# EAGLE schematic motorline (EAGLE 9.5.1)
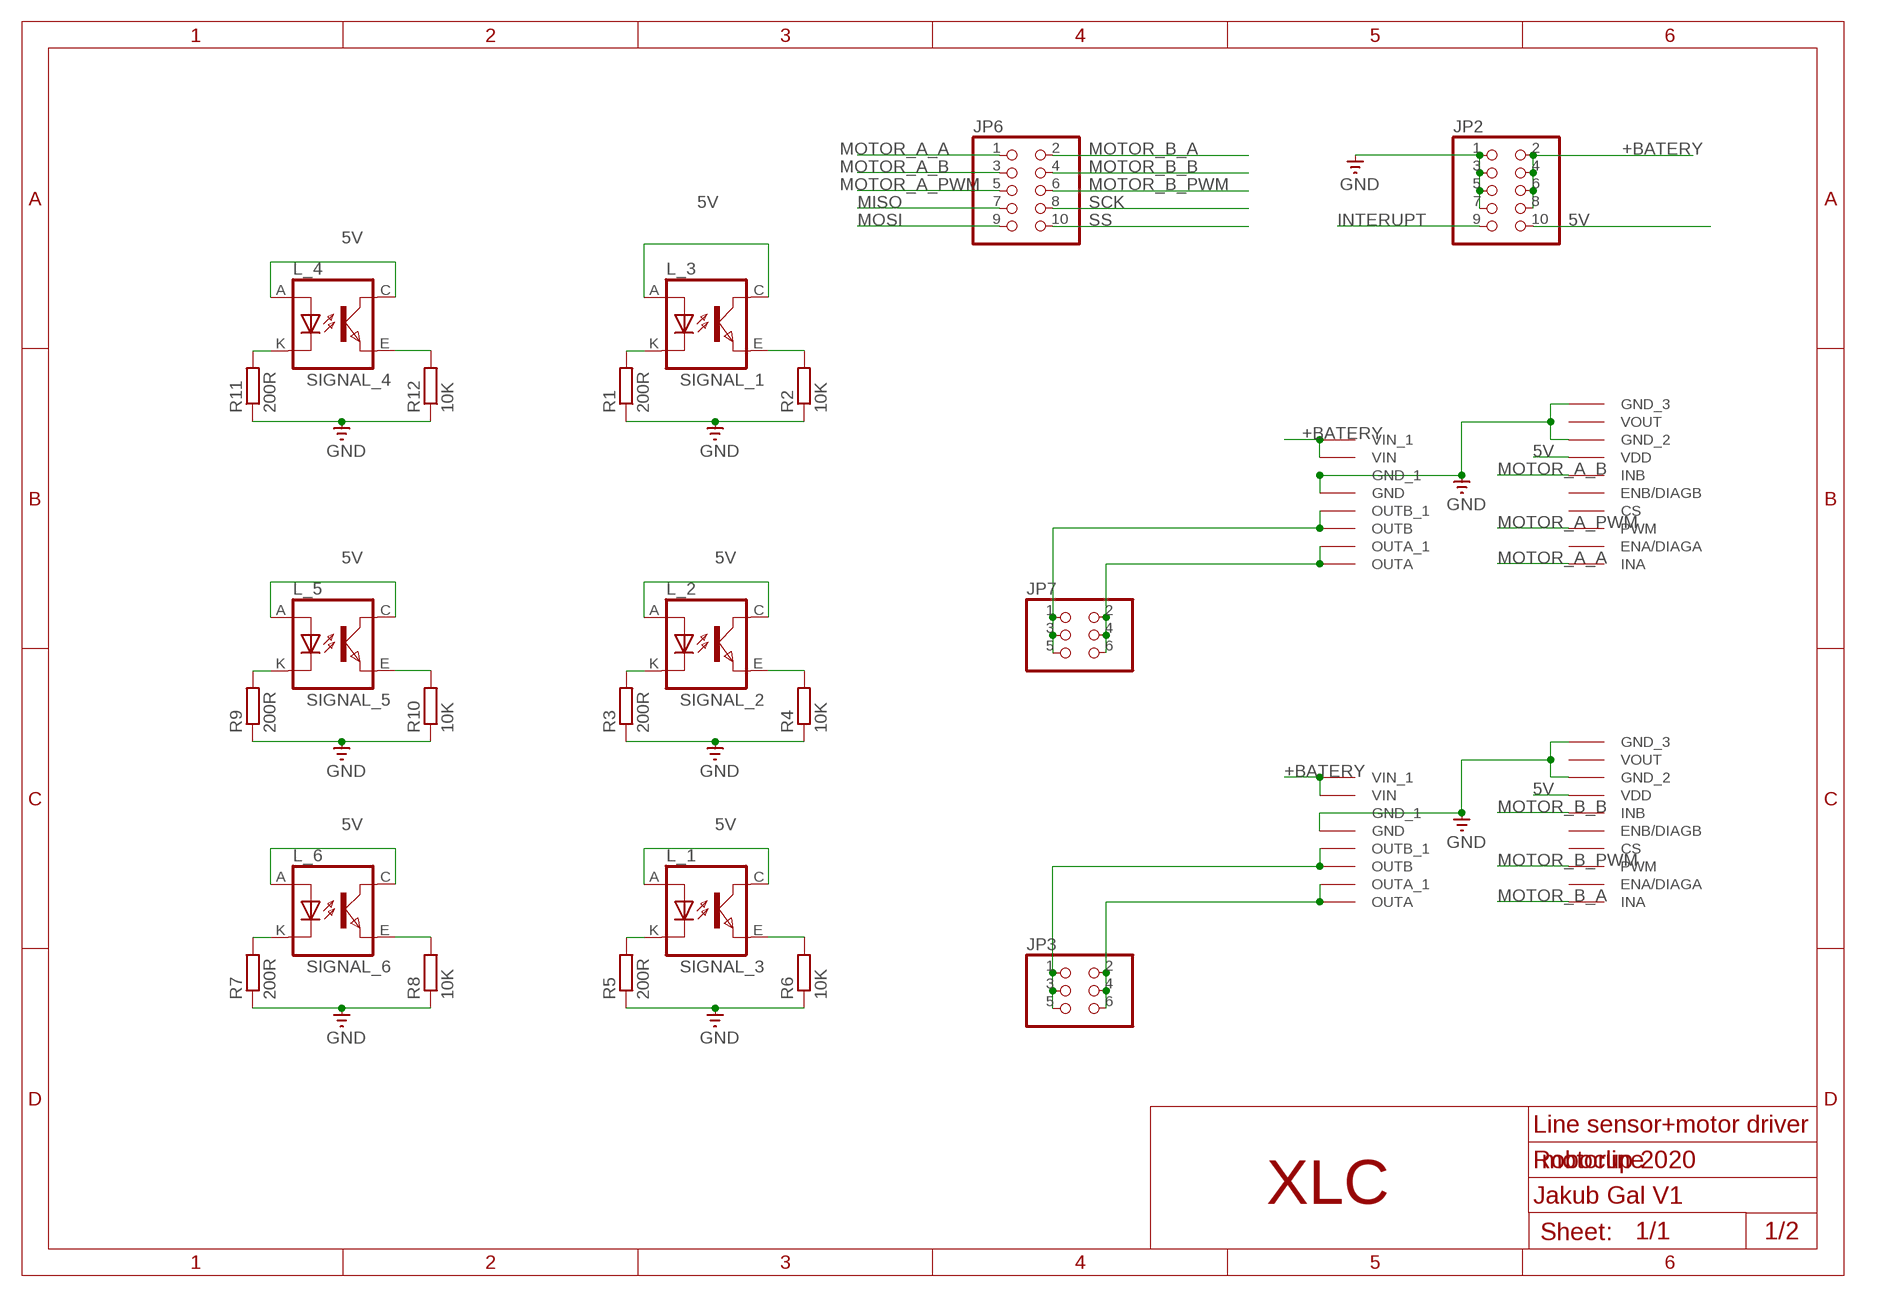
[diagram p0: schematic, sheet 1, part 1 of 2]
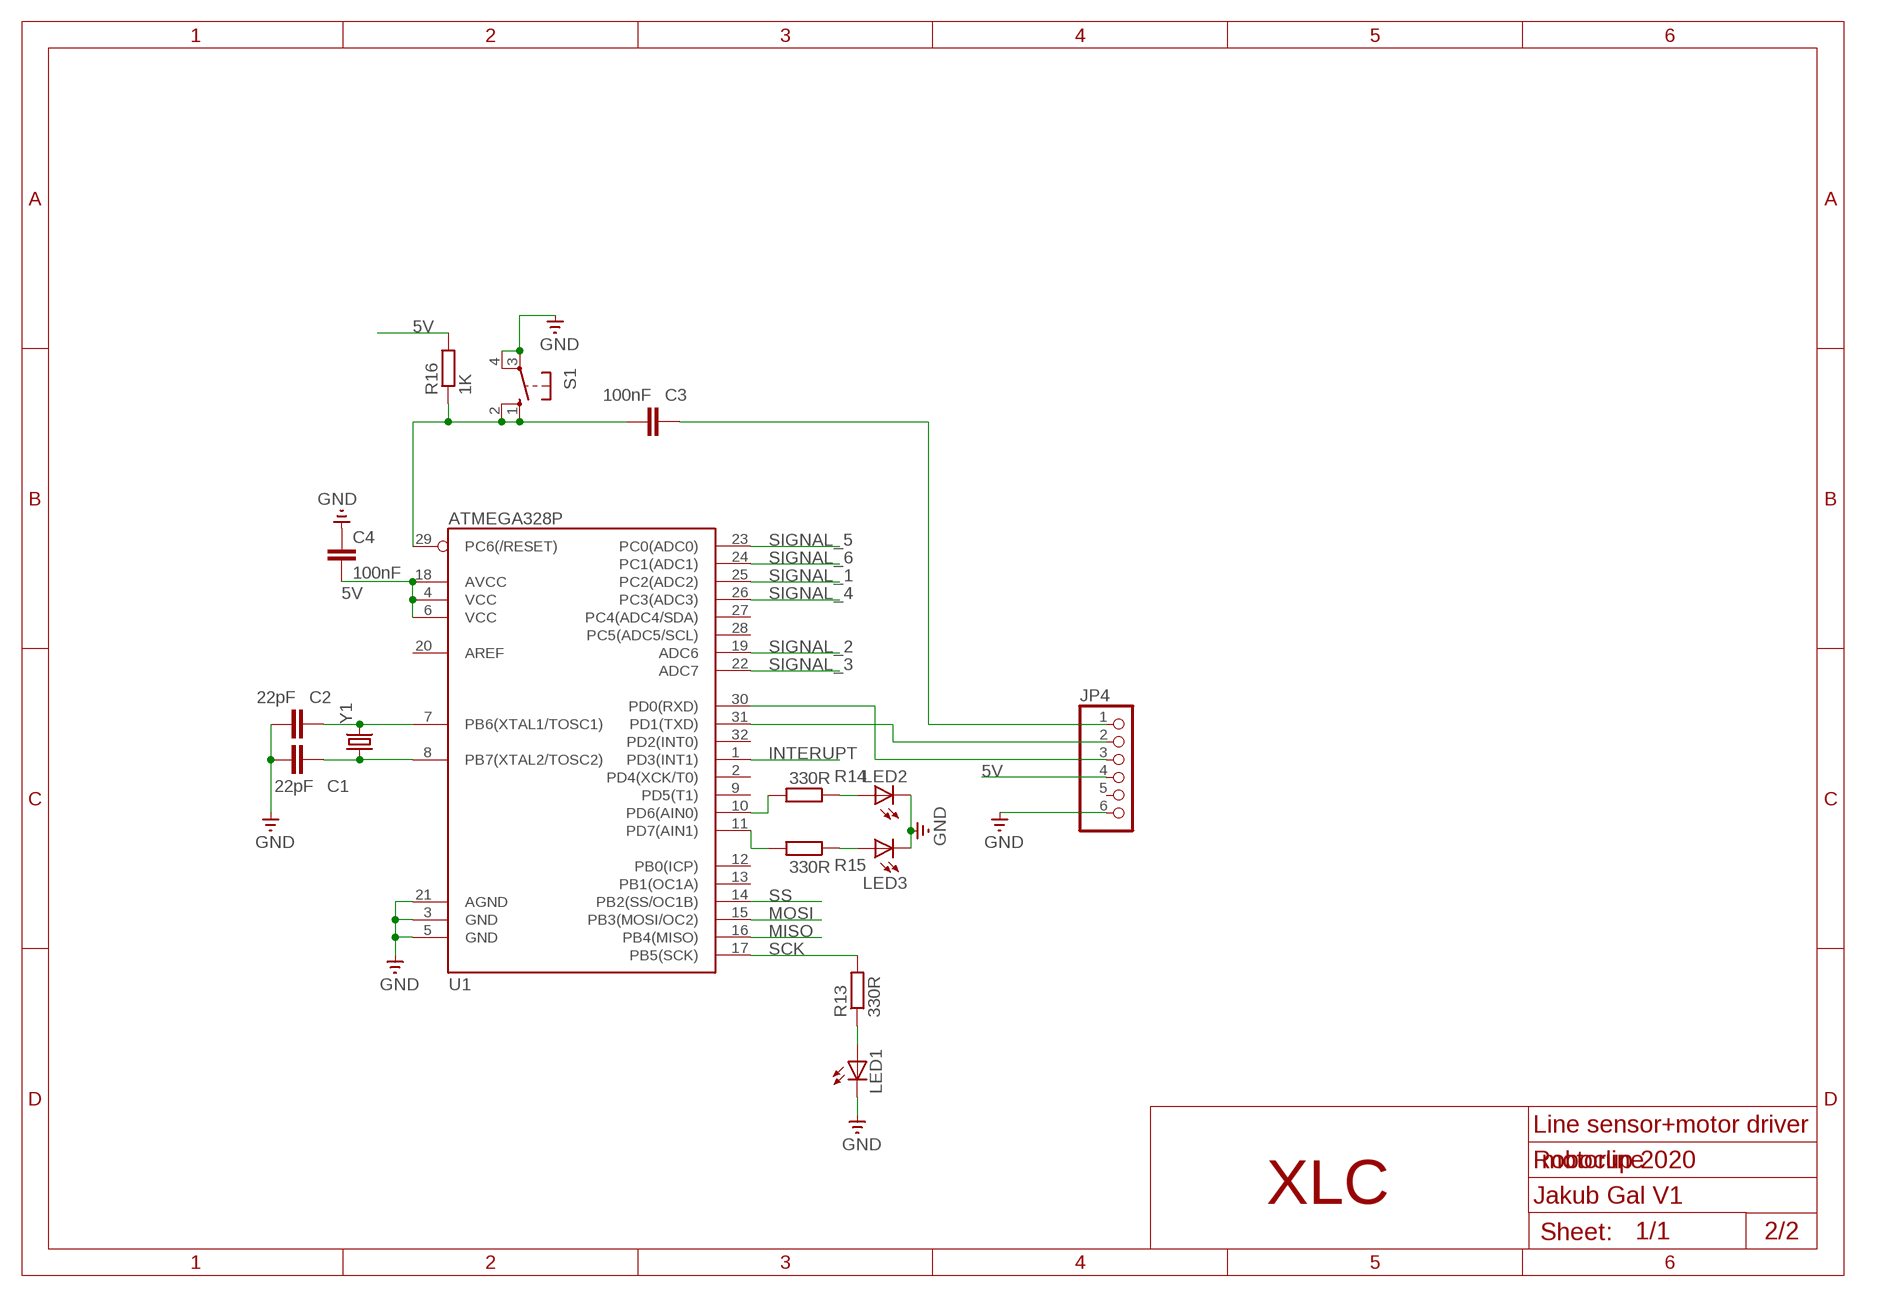
[diagram p1: schematic, sheet 1, part 2 of 2]

## Parts
C1  22pF  C-EUC0603  [C0603]
C2  22pF  C-EUC0603  [C0603]
C3  100nF  C-EUC0603  [C0603]
C4  100nF  C-EUC0603  [C0603]
JP2  PINHD-2X5IDC  [2X05_IDC]
JP3  PINHD-2X3IDC  [2X03_IDC]
JP4  PINHD-1X6_2.54-90°  [1X06/90]
JP6  PINHD-2X5IDC  [2X05_IDC]
JP7  PINHD-2X3IDC  [2X03_IDC]
L_1  TCRT5000  [TCRT5000]
L_2  TCRT5000  [TCRT5000]
L_3  TCRT5000  [TCRT5000]
L_4  TCRT5000  [TCRT5000]
L_5  TCRT5000  [TCRT5000]
L_6  TCRT5000  [TCRT5000]
LED1  LEDCHIPLED_0603  [CHIPLED_0603]
LED2  LEDCHIPLED_0603  [CHIPLED_0603]
LED3  LEDCHIPLED_0603  [CHIPLED_0603]
R1  200R  R-EU_R0603  [R0603]
R2  10K  R-EU_R0603  [R0603]
R3  200R  R-EU_R0603  [R0603]
R4  10K  R-EU_R0603  [R0603]
R5  200R  R-EU_R0603  [R0603]
R6  10K  R-EU_R0603  [R0603]
R7  200R  R-EU_R0603  [R0603]
R8  10K  R-EU_R0603  [R0603]
R9  200R  R-EU_R0603  [R0603]
R10  10K  R-EU_R0603  [R0603]
R11  200R  R-EU_R0603  [R0603]
R12  10K  R-EU_R0603  [R0603]
R13  330R  R-EU_R0603  [R0603]
R14  330R  R-EU_R0603  [R0603]
R15  330R  R-EU_R0603  [R0603]
R16  1K  R-EU_R0603  [R0603]
S1  10-XX  [B3F-10XX]
U1  ATMEGA328P  ATMEGA328_SMT  [TQFP32-08]
U$1  MOTOR_DRIVER  [MOTOR_DRIVER]
U$2  MOTOR_DRIVER  [MOTOR_DRIVER]
Y1  CRYSTALHC49US  [HC49US]

## Nets
5V: C4.2 JP2.10 JP4.4 L_1.A(ANODE) L_1.C(COLLECTOR) L_2.A(ANODE) L_2.C(COLLECTOR) L_3.A(ANODE) L_3.C(COLLECTOR) L_4.A(ANODE) L_4.C(COLLECTOR) L_5.A(ANODE) L_5.C(COLLECTOR) L_6.A(ANODE) L_6.C(COLLECTOR) R16.2 U1.4(VCC) U1.6(VCC) U1.18(AVCC) U$1.VDD U$2.VDD
+BATERY: JP2.2 JP2.4 JP2.6 JP2.8 U$1.VIN U$1.VIN_1 U$2.VIN U$2.VIN_1
GND: C1.1 C2.1 C4.1 JP2.1 JP2.3 JP2.5 JP2.7 JP4.6 LED1.C LED2.C LED3.C R1.1 R2.1 R3.1 R4.1 R5.1 R6.1 R7.1 R8.1 R9.1 R10.1 R11.1 R12.1 S1.3(P) S1.4(P1) U1.3(GND) U1.5(GND) U1.21(AGND) U$1.GND U$1.GND_1 U$1.GND_2 U$1.GND_3 U$2.GND U$2.GND_1 U$2.GND_2 U$2.GND_3
INTERUPT: JP2.9 U1.1(PD3(INT1))
MISO: JP6.7 U1.16(PB4(MISO))
MOSI: JP6.9 U1.15(PB3(MOSI/OC2))
MOTOR_1_1: JP7.1 JP7.3 JP7.5 U$1.OUTB U$1.OUTB_1
MOTOR_1_2: JP7.2 JP7.4 JP7.6 U$1.OUTA U$1.OUTA_1
MOTOR_2_1: JP3.2 JP3.4 JP3.6 U$2.OUTA U$2.OUTA_1
MOTOR_2_2: JP3.1 JP3.3 JP3.5 U$2.OUTB U$2.OUTB_1
MOTOR_A_A: JP6.1 U$1.INA
MOTOR_A_B: JP6.3 U$1.INB
MOTOR_A_PWM: JP6.5 U$1.PWM
MOTOR_B_A: JP6.2 U$2.INA
MOTOR_B_B: JP6.4 U$2.INB
MOTOR_B_PWM: JP6.6 U$2.PWM
N$1: L_3.K(CATHODE) R1.2
N$2: L_2.K(CATHODE) R3.2
N$3: L_1.K(CATHODE) R5.2
N$4: L_6.K(CATHODE) R7.2
N$5: L_5.K(CATHODE) R9.2
N$6: L_4.K(CATHODE) R11.2
N$7: C2.2 U1.7(PB6(XTAL1/TOSC1)) Y1.2
N$8: C1.2 U1.8(PB7(XTAL2/TOSC2)) Y1.1
N$13: JP4.3 U1.30(PD0(RXD))
N$14: JP4.2 U1.31(PD1(TXD))
N$15: C3.2 JP4.1
N$16: C3.1 R16.1 S1.1(S) S1.2(S1) U1.29(PC6(/RESET))
N$17: LED1.A R13.1
N$19: LED2.A R14.1
N$20: R15.2 U1.11(PD7(AIN1))
N$21: LED3.A R15.1
N$22: R14.2 U1.10(PD6(AIN0))
SCK: JP6.8 R13.2 U1.17(PB5(SCK))
SIGNAL_1: L_3.E(EMITTER) R2.2 U1.25(PC2(ADC2))
SIGNAL_2: L_2.E(EMITTER) R4.2 U1.19(ADC6)
SIGNAL_3: L_1.E(EMITTER) R6.2 U1.22(ADC7)
SIGNAL_4: L_4.E(EMITTER) R12.2 U1.26(PC3(ADC3))
SIGNAL_5: L_5.E(EMITTER) R10.2 U1.23(PC0(ADC0))
SIGNAL_6: L_6.E(EMITTER) R8.2 U1.24(PC1(ADC1))
SS: JP6.10 U1.14(PB2(SS/OC1B))
Unconnected: JP4.5 U1.2(PD4(XCK/T0)) U1.9(PD5(T1)) U1.12(PB0(ICP)) U1.13(PB1(OC1A)) U1.20(AREF) U1.27(PC4(ADC4/SDA)) U1.28(PC5(ADC5/SCL)) U1.32(PD2(INT0)) U$1.CS U$1.ENA/DIAGA U$1.ENB/DIAGB U$1.VOUT U$2.CS U$2.ENA/DIAGA U$2.ENB/DIAGB U$2.VOUT

## Notes on the sheet
- Line sensor+motor driver | Line sensor+motor driver
- Robocup 2020 | Robocup 2020
- XLC | Jakub Gal V1 | XLC | Jakub Gal V1
- 1/2 | 2/2

## Library data of the parts
C1-C3 = rcl:C-EU: CAPACITOR, European symbol
C4 = rcl:C-EU: CAPACITOR, European symbol; SPICEPREFIX: C
JP2 JP6 = pinhead-1:PINHD-2X5: PIN HEADER
JP3 JP7 = pinhead-1:PINHD-2X3: PIN HEADER
JP4 = pinhead-1:PINHD-1X6: PIN HEADER
L_1-L_3 L_5 = tcrt5000:TCRT5000
L_4 L_6 = tcrt5000:TCRT5000; SPICEPREFIX: O
LED1-LED3 = audio amplifier example:LED
R1-R16 = rcl:R-EU_: RESISTOR, European symbol; SPICEPREFIX: R
S1 = switch-omron:10-XX: OMRON SWITCH; MPN: B3F-1000; OC_FARNELL: 176432; OC_NEWARK: 36M3542
U1 = SparkFun-DigitalIC:ATMEGA328_SMT: 32-Pin Atmega328 part Commonly used on Arduino compatible boards Available in QFP and QFN packages TQFP is IC-09069 QFN is non-stock; PROD_ID: IC-09069
U$1 U$2 = Moja:MOTOR_DRIVER
Y1 = SparkFun-FreqCtrl:CRYSTAL: Various standard crystals. Proven footprints. Spark Fun Electronics SKU : COM-00534